# Altium project ADS1256.PrjPcb
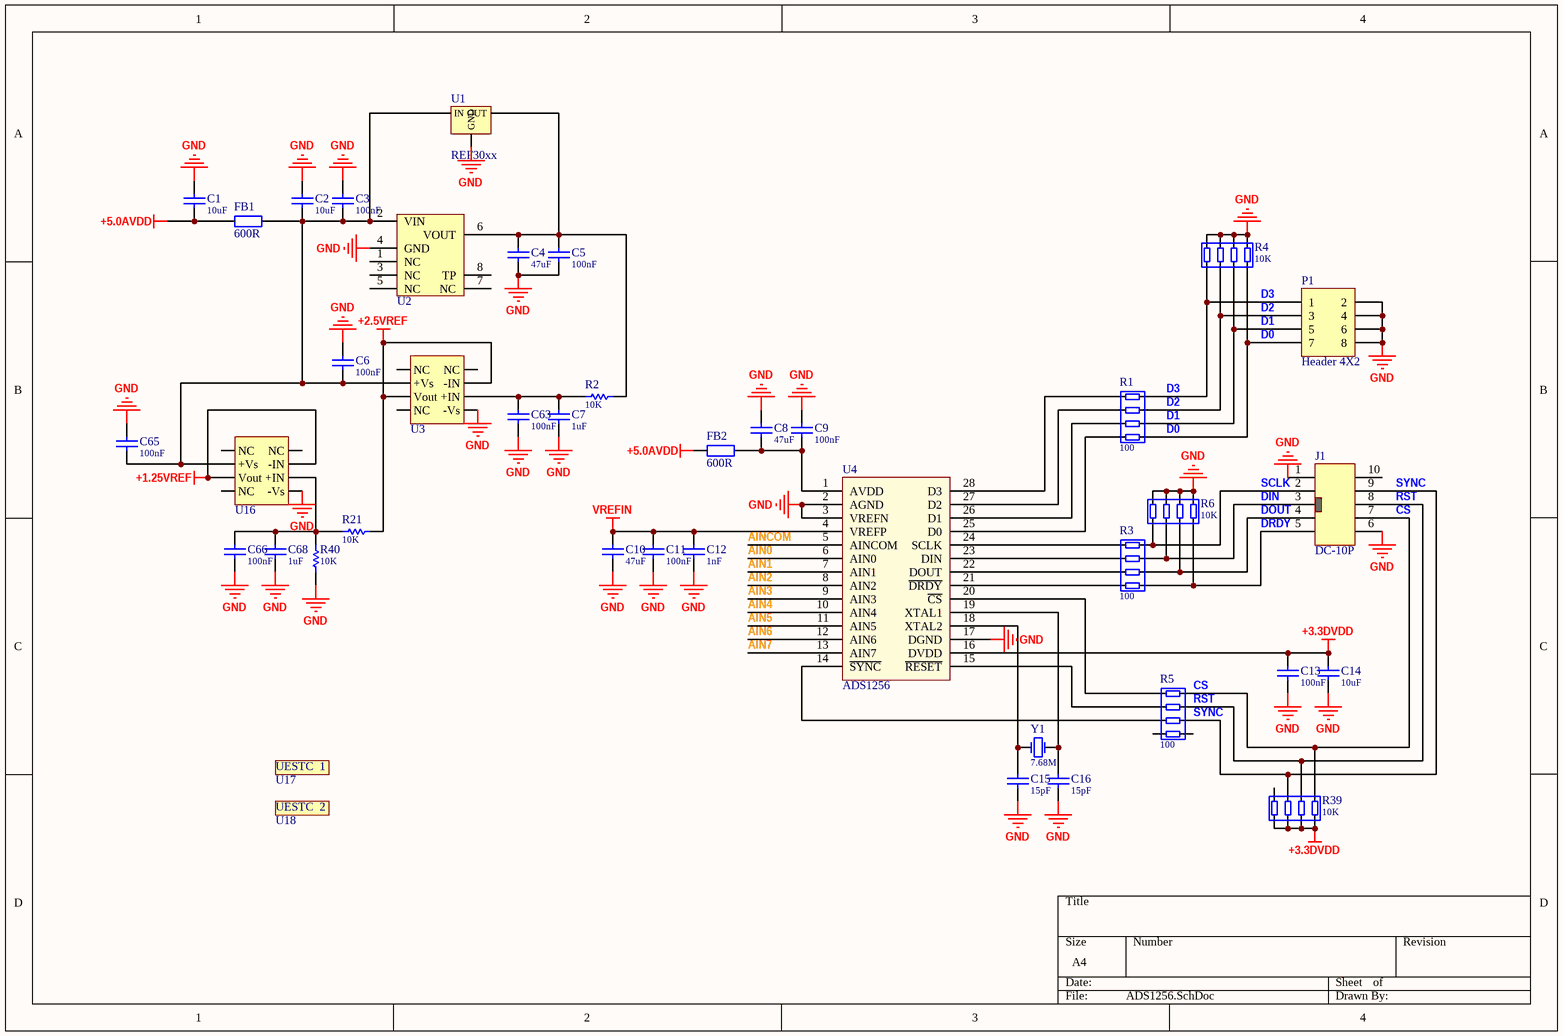
[diagram p0: ADS1256.SchDoc]
3 sheets, 175 parts. Net scope: global (net labels, ports and power ports of the same name join across sheets).
Board file: ADS1256.PcbDoc
Sheets:
  ADS1256.SchDoc
  POWER.SchDoc
  Analog.SchDoc

## Sheet ADS1256.SchDoc
size A4

### Parts
C1  value 10uF  [C0603-L]  (hidden comment: Cap-S)
C2  value 10uF  [C0603-L]  (hidden comment: Cap-S)
C3  value 100nF  [C0402-L]  (hidden comment: Cap-S)
C4  value 47uF  [C0805-L]  (hidden comment: Cap-S)
C5  value 100nF  [C0402-L]  (hidden comment: Cap-S)
C6  value 100nF  [C0402-L]  (hidden comment: Cap-S)
C7  value 1uF  [C0603-L]  (hidden comment: Cap-S)
C8  value 47uF  [C0805-L]  (hidden comment: Cap-S)
C9  value 100nF  [C0402-L]  (hidden comment: Cap-S)
C10  value 47uF  [C0805-L]  (hidden comment: Cap-S)
C11  value 100nF  [C0402-L]  (hidden comment: Cap-S)
C12  value 1nF  [C0402-L]  (hidden comment: Cap-S)
C13  value 100nF  [C0402-L]  (hidden comment: Cap-S)
C14  value 10uF  [C0603-L]  (hidden comment: Cap-S)
C15  value 15pF  [C0603-L]  (hidden comment: Cap-S)
C16  value 15pF  [C0603-L]  (hidden comment: Cap-S)
C63  value 100nF  [C0402-L]  (hidden comment: Cap-S)
C65  value 100nF  [C0402-L]  (hidden comment: Cap-S)
C66  value 100nF  [C0402-L]  (hidden comment: Cap-S)
C68  value 1uF  [C0603-L]  (hidden comment: Cap-S)
FB1  600R  [FB-0805]
FB2  600R  [FB-0805]
J1  DC-10P  [DC-10P]
P1  Header 4X2  [HDR2X4]
R1  value 100  [R0603X4]  (hidden comment: R)
R2  value 10K  [R0603-L]  (hidden comment: R)
R3  value 100  [R0603X4]  (hidden comment: R)
R4  value 10K  [R0603X4]  (hidden comment: R)
R5  value 100  [R0603X4]  (hidden comment: R)
R6  value 10K  [R0603X4]  (hidden comment: R)
R21  value 10K  [R0603-L]  (hidden comment: R)
R39  value 10K  [R0603X4]  (hidden comment: R)
R40  value 10K  [R0603-L]  (hidden comment: R)
U1  REF30xx  [SOT23-3_L]
U2  ADR45xx  [SOIC-8_N]  (value not drawn)
U3  OPA657  [SOIC-8_N]  (value not drawn)
U4  ADS1256  [TSSOP-28]
U16  OPA657  [SOIC-8_N]  (value not drawn)
U17  UESTC  1  [UESTC]  (value not drawn)
U18  UESTC  2  [UESTC  2]  (value not drawn)
Y1  value 7.68M  [XTAL-PB2-SMD]  (hidden comment: XTAL)

### Nets
+1.25VREF: U16.2(-IN) U16.6(Vout)
+2.5VREF: R21.2 U3.2(-IN) U3.6(Vout)
+3.3DVDD: C13.2 C14.2 R39.1 R39.2 R39.3 R39.4 U4.16(DVDD)
+5.0AVDD: C1.1 FB1.1 FB2.1
GND: C1.2 C2.2 C3.1 C4.1 C5.1 C6.1 C7.1 C8.2 C9.1 C10.2 C11.1 C12.1 C13.1 C14.1 C15.2 C16.2 C63.1 C65.1 C66.1 C68.1 J1.1 J1.6 P1.2 P1.4 P1.6 P1.8 R4.5 R4.6 R4.7 R4.8 R6.5 R6.6 R6.7 R6.8 R40.1 U1.3(GND) U2.4(GND) U3.4(-Vs) U4.2(AGND) U4.3(VREFN) U4.17(DGND) U16.4(-Vs)
VREFIN: C10.1 C11.2 C12.2 U4.4(VREFP)
AIN0: U4.6(AIN0)
AIN1: U4.7(AIN1)
AIN2: U4.8(AIN2)
AIN3: U4.9(AIN3)
AIN4: U4.10(AIN4)
AIN5: U4.11(AIN5)
AIN6: U4.12(AIN6)
AIN7: U4.13(AIN7)
AINCOM: U4.5(AINCOM)
CS: J1.7 R5.8 R39.8
D0: P1.7 R1.5 R4.1
D1: P1.5 R1.6 R4.2
D2: P1.3 R1.7 R4.3
D3: P1.1 R1.8 R4.4
DIN: J1.3 R3.7 R6.3
DOUT: J1.4 R3.6 R6.2
DRDY: J1.5 R3.5 R6.1
RST: J1.8 R5.7 R39.7
SCLK: J1.2 R3.8 R6.4
SYNC: J1.9 R5.6 R39.6
NetC2_1: C2.1 C3.2 C6.2 C65.2 FB1.2 U1.1(IN) U2.2(VIN) U3.7(+Vs) U16.7(+Vs)
NetC4_2: C4.2 C5.2 R2.2 U1.2(OUT) U2.6(VOUT)
NetC7_2: C7.2 C63.2 R2.1 U3.3(+IN)
NetC8_1: C8.1 C9.2 FB2.2 U4.1(AVDD)
NetC15_1: C15.1 U4.18(XTAL2) Y1.2(OSC2)
NetC16_1: C16.1 U4.19(XTAL1) Y1.1(OSC1)
NetC66_2: C66.2 C68.2 R21.1 R40.2 U16.3(+IN)
NetR1_1: R1.1 U4.28(D3)
NetR1_2: R1.2 U4.27(D2)
NetR1_3: R1.3 U4.26(D1)
NetR1_4: R1.4 U4.25(D0)
NetR3_1: R3.1 U4.24(SCLK)
NetR3_2: R3.2 U4.23(DIN)
NetR3_3: R3.3 U4.22(DOUT)
NetR3_4: R3.4 U4.21(~{DRDY})
NetR5_1: R5.1 U4.20(~{CS})
NetR5_2: R5.2 U4.15(~{RESET})
NetR5_3: R5.3 U4.14(~{SYNC})

Not connected (* = marked no-connect by the designer): J1 10; R5 4 5; R39 5; U2 1(NC) 3(NC) 5(NC) 7(NC) 8(TP); U3 1(NC) 5(NC) 8(NC); U16 1(NC) 5(NC) 8(NC)

### Library data of the parts
C1-C16 C63 C65 C66 C68 = Cap-S: 贴片瓷片电容
FB1 FB2 = FB
P1 = Header 4X2: Header, 4-Pin, Dual row; LatestRevisionDate: 17-Jul-2002; LatestRevisionNote: Re-released for DXP Platform.; Publisher: Altium Limited
R1 R3-R6 R39 = Res-4R: 排阻 4
R2 R21 R40 = Res: 贴片电阻
U1 = REF3025: 采用 SOT23-3 封装的 2.5V 输出 50ppm/℃ 漂移 50uA 静态电流的（带隙）电压参考
U2 = ADR45xx: 超低噪声、高精度  基准电压源
U3 U16 = OPA657: 1.6-GHz, Low-Noise, FET-Input Operational Amplifier; Manufacturer: Texas Instruments; PartNumber: OPA656U; 2nd Harmonic(dBc): 74; 3rd Harmonic(dBc): 100; @ MHz: 5; Acl, min stable gain(V/V): 1; BW @ Acl(MHz): 500; Diff Gain(%): 0.02; Diff Phase(deg): 0.05; Eco-Plan: Green (RoHS & no Sb/Br); Io(Typ)(mA): 70; Iq per channel(Max)(mA): 16; Slew Rate(Typ)(V/us): 290; Sub Family: High Output Current Amplifier (>=50mA), High Speed Amplifier (>=50MHz), Low Input Bias Current Amp (<=10pA); THD (Fc is 1 MHz)(Typ)(dB): -74; Vio(Max)(mV): 0.6; Vn at Flatband(Typ)(nV/rtHz): 7; Vs(Max)(V): 12; Vs(Min)(V): 10; DatasheetVersion: SBOS196G; PackageVersion: 4040047-3/M, 06/2011; PackageReference: D8; PackageDescription: 8-Pin Plastic Small Outline, Body 4.9 x 3.9 mm, Pitch 1.27 mm; Supplier 1: Digi-Key; Supplier Part Number 1: OPA656U-ND; Supplier 2: Farnell; Supplier Part Number 2: 1212322; Supplier 3: Newark; Supplier Part Number 3: 75C5137; Supplier 4: Mouser; Supplier Part Number 4: 595-OPA656U; Iib(Max)(nA): 0.02; Number of Channels: 1; Settling Time (0.1%)(Typ)(ns): 16; Mounting Technology: Surface Mount; Code_JEDEC: MS-012; ComponentLink1Description: Manufacturer URL; ComponentLink1URL: http://www.ti.com/; ComponentLink2Description: Datasheet; ComponentLink2URL: http://www.ti.com/general/docs/lit/getliterature.tsp?genericPartNumber=OPA656&fileType=pdf; ComponentLink3Description: Package Specification; ComponentLink3URL: http://www.ti.com/litv/pdf/msoi002j
Y1 = XTAL: 晶振

## Sheet POWER.SchDoc
size A4
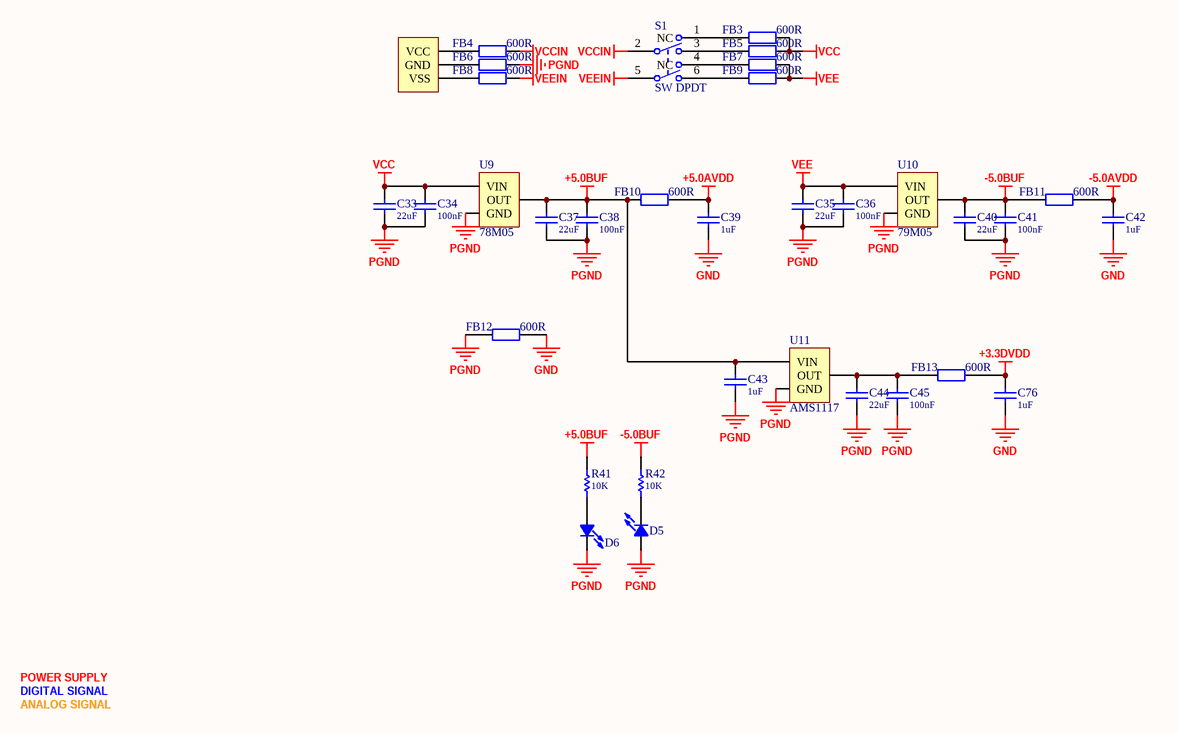
[diagram p1: POWER.SchDoc]

### Parts
C33  value 22uF  [C0805-L]  (hidden comment: Cap-S)
C34  value 100nF  [C0603-L]  (hidden comment: Cap-S)
C35  value 22uF  [C0805-L]  (hidden comment: Cap-S)
C36  value 100nF  [C0603-L]  (hidden comment: Cap-S)
C37  value 22uF  [C0805-L]  (hidden comment: Cap-S)
C38  value 100nF  [C0603-L]  (hidden comment: Cap-S)
C39  value 1uF  [C0603-L]  (hidden comment: Cap-S)
C40  value 22uF  [C0805-L]  (hidden comment: Cap-S)
C41  value 100nF  [C0603-L]  (hidden comment: Cap-S)
C42  value 1uF  [C0603-L]  (hidden comment: Cap-S)
C43  value 1uF  [C0603-L]  (hidden comment: Cap-S)
C44  value 22uF  [C0805-L]  (hidden comment: Cap-S)
C45  value 100nF  [C0603-L]  (hidden comment: Cap-S)
C76  value 1uF  [C0603-L]  (hidden comment: Cap-S)
D5  LED  [Led-0805_L]  (value not drawn)
D6  LED  [Led-0805_L]  (value not drawn)
FB3  600R  [FB-0805]
FB4  600R  [FB-0805]
FB5  600R  [FB-0805]
FB6  600R  [FB-0805]
FB7  600R  [FB-0805]
FB8  600R  [FB-0805]
FB9  600R  [FB-0805]
FB10  600R  [FB-0805]
FB11  600R  [FB-0805]
FB12  600R  [FB-0805]
FB13  600R  [FB-0805]
J2  Power-3P  [SIPA03]  (value not drawn)
R41  value 10K  [R0603-L]  (hidden comment: R)
R42  value 10K  [R0603-L]  (hidden comment: R)
S1  SW DPDT  [SW_DPDT]
U9  78M05  [TO-252]
U10  79M05  [TO-252]
U11  AMS1117  [SOT-223]

### Nets
+3.3DVDD: C76.2 FB13.2
+5.0AVDD: C39.2 FB10.2
+5.0BUF: C37.2 C38.2 C43.2 FB10.1 R41.2 U9.3(OUT) U11.3(VIN)
-5.0AVDD: C42.2 FB11.2
-5.0BUF: C40.2 C41.2 FB11.1 R42.2 U10.3(OUT)
GND: C39.1 C42.1 C76.1 FB12.2
PGND: C33.1 C34.1 C35.1 C36.1 C37.1 C38.1 C40.1 C41.1 C43.1 C44.1 C45.1 D5.1 D6.2 FB6.2 FB12.1 U9.2(GND) U10.1(GND) U11.1(GND)
VCC: C33.2 C34.2 FB3.2 FB5.2 U9.1(VIN)
VCCIN: FB4.2 S1.2
VEE: C35.2 C36.2 FB7.2 FB9.2 U10.2(VIN)
VEEIN: FB8.2 S1.5(COMMON2)
NetC44_2: C44.2 C45.2 FB13.1 U11.2(OUT)
NetD5_2: D5.2 R42.1
NetD6_1: D6.1 R41.1
NetFB3_1: FB3.1 S1.1(NC)
NetFB4_1: FB4.1 J2.1(VCC)
NetFB5_1: FB5.1 S1.3(NO1)
NetFB6_1: FB6.1 J2.2(GND)
NetFB7_1: FB7.1 S1.4(NC)
NetFB8_1: FB8.1 J2.3(VSS)
NetFB9_1: FB9.1 S1.6(NO2)

### Notes on the sheet
- Labels drawn without touching a wire or pin: ANALOG SIGNAL, DIGITAL SIGNAL, POWER SUPPLY

### Library data of the parts
C33-C45 C76 = Cap-S: 贴片瓷片电容
D5 D6 = LED: 发光二极管
FB3-FB13 = FB
J2 = Power-3P: 供电端子
R41 R42 = Res: 贴片电阻
S1 = SW DPDT: 自锁开关; Published: 24-Mar-1999; LatestRevisionDate: 29-May-2009; LatestRevisionNote: IPC-7351 Footprint Added.; PackageVersion: Mar-2001; PackageReference: SOT23-6; Publisher: Altium Limited; PackageDescription: 6-Pin SOT-23 Package 0.95 mm Pitch, 2.7 mm Lead Span; Code_JEITA: SC-74; Code_IPC: SOT26A-6

## Sheet Analog.SchDoc
size A3
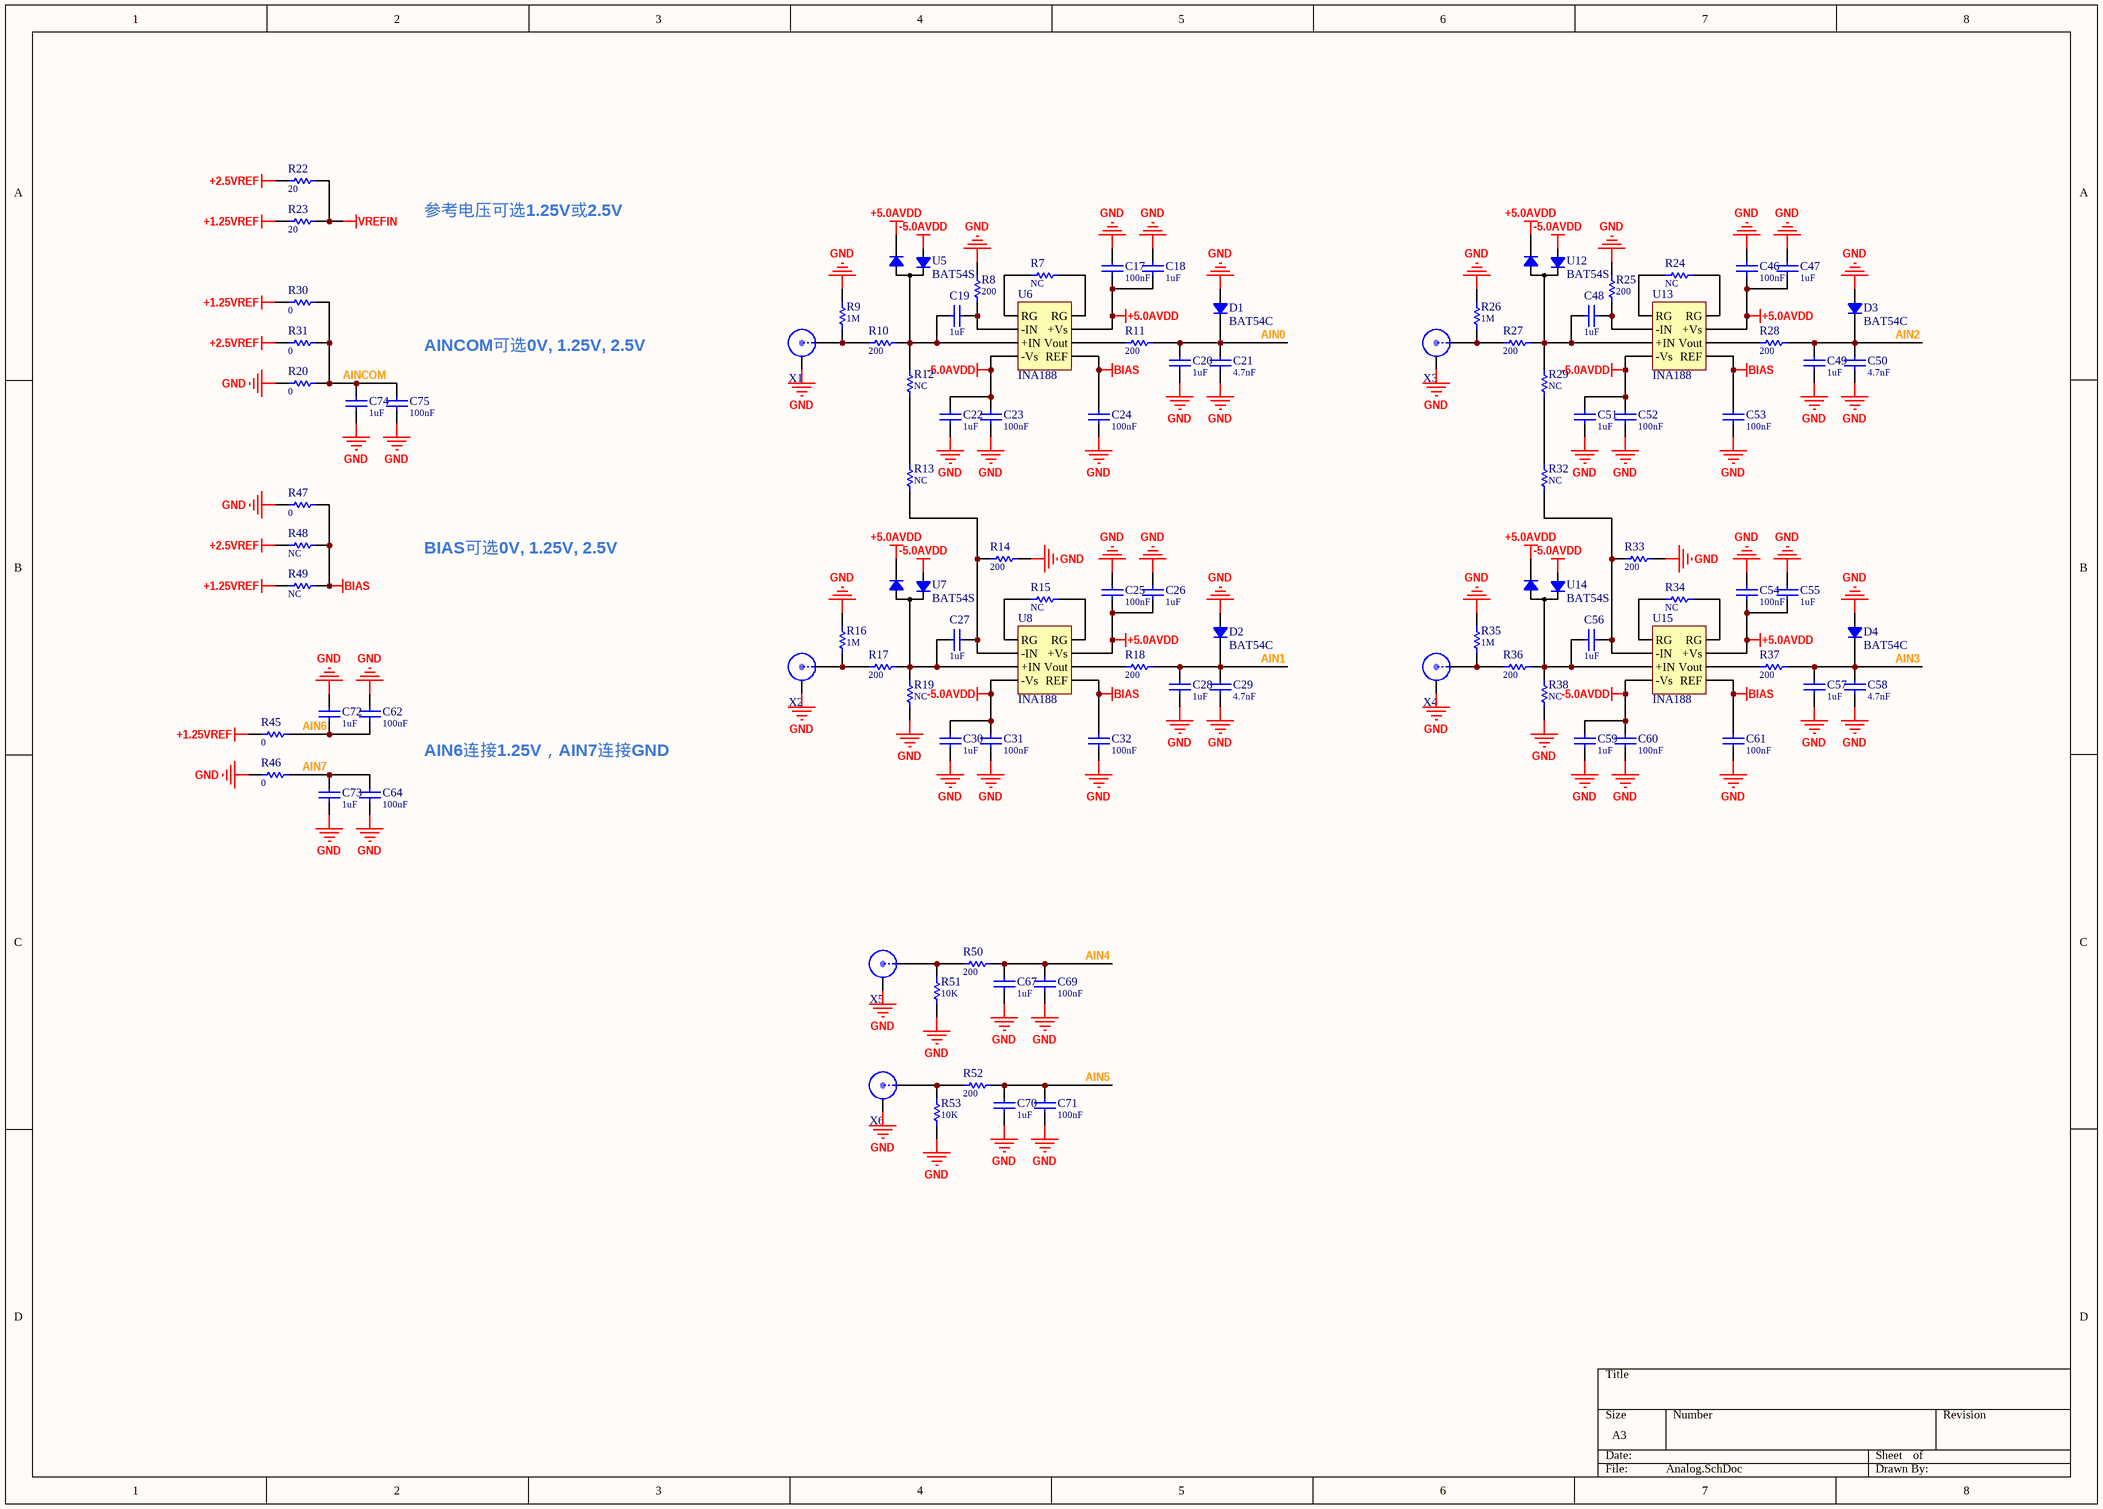
[diagram p2: Analog.SchDoc]

### Parts
C17  value 100nF  [C0402-L]  (hidden comment: Cap-S)
C18  value 1uF  [C0603-L]  (hidden comment: Cap-S)
C19  value 1uF  [C0603-L]  (hidden comment: Cap-S)
C20  value 1uF  [C0603-L]  (hidden comment: Cap-S)
C21  value 4.7nF  [C0402-L]  (hidden comment: Cap-S)
C22  value 1uF  [C0603-L]  (hidden comment: Cap-S)
C23  value 100nF  [C0402-L]  (hidden comment: Cap-S)
C24  value 100nF  [C0402-L]  (hidden comment: Cap-S)
C25  value 100nF  [C0402-L]  (hidden comment: Cap-S)
C26  value 1uF  [C0603-L]  (hidden comment: Cap-S)
C27  value 1uF  [C0603-L]  (hidden comment: Cap-S)
C28  value 1uF  [C0603-L]  (hidden comment: Cap-S)
C29  value 4.7nF  [C0402-L]  (hidden comment: Cap-S)
C30  value 1uF  [C0603-L]  (hidden comment: Cap-S)
C31  value 100nF  [C0402-L]  (hidden comment: Cap-S)
C32  value 100nF  [C0402-L]  (hidden comment: Cap-S)
C46  value 100nF  [C0402-L]  (hidden comment: Cap-S)
C47  value 1uF  [C0603-L]  (hidden comment: Cap-S)
C48  value 1uF  [C0603-L]  (hidden comment: Cap-S)
C49  value 1uF  [C0603-L]  (hidden comment: Cap-S)
C50  value 4.7nF  [C0402-L]  (hidden comment: Cap-S)
C51  value 1uF  [C0603-L]  (hidden comment: Cap-S)
C52  value 100nF  [C0402-L]  (hidden comment: Cap-S)
C53  value 100nF  [C0402-L]  (hidden comment: Cap-S)
C54  value 100nF  [C0402-L]  (hidden comment: Cap-S)
C55  value 1uF  [C0603-L]  (hidden comment: Cap-S)
C56  value 1uF  [C0603-L]  (hidden comment: Cap-S)
C57  value 1uF  [C0603-L]  (hidden comment: Cap-S)
C58  value 4.7nF  [C0402-L]  (hidden comment: Cap-S)
C59  value 1uF  [C0603-L]  (hidden comment: Cap-S)
C60  value 100nF  [C0402-L]  (hidden comment: Cap-S)
C61  value 100nF  [C0402-L]  (hidden comment: Cap-S)
C62  value 100nF  [C0402-L]  (hidden comment: Cap-S)
C64  value 100nF  [C0402-L]  (hidden comment: Cap-S)
C67  value 1uF  [C0603-L]  (hidden comment: Cap-S)
C69  value 100nF  [C0402-L]  (hidden comment: Cap-S)
C70  value 1uF  [C0603-L]  (hidden comment: Cap-S)
C71  value 100nF  [C0402-L]  (hidden comment: Cap-S)
C72  value 1uF  [C0603-L]  (hidden comment: Cap-S)
C73  value 1uF  [C0603-L]  (hidden comment: Cap-S)
C74  value 1uF  [C0603-L]  (hidden comment: Cap-S)
C75  value 100nF  [C0402-L]  (hidden comment: Cap-S)
D1  BAT54C  [SOT-23-2]
D2  BAT54C  [SOT-23-2]
D3  BAT54C  [SOT-23-2]
D4  BAT54C  [SOT-23-2]
R7  value NC  [R0603-L]  (hidden comment: R)
R8  value 200  [R0603-L]  (hidden comment: R)
R9  value 1M  [R0603-L]  (hidden comment: R)
R10  value 200  [R0603-L]  (hidden comment: R)
R11  value 200  [R0603-L]  (hidden comment: R)
R12  value NC  [R0603-L]  (hidden comment: R)
R13  value NC  [R0603-L]  (hidden comment: R)
R14  value 200  [R0603-L]  (hidden comment: R)
R15  value NC  [R0603-L]  (hidden comment: R)
R16  value 1M  [R0603-L]  (hidden comment: R)
R17  value 200  [R0603-L]  (hidden comment: R)
R18  value 200  [R0603-L]  (hidden comment: R)
R19  value NC  [R0603-L]  (hidden comment: R)
R20  value 0  [R0603-L]  (hidden comment: R)
R22  value 20  [R0603-L]  (hidden comment: R)
R23  value 20  [R0603-L]  (hidden comment: R)
R24  value NC  [R0603-L]  (hidden comment: R)
R25  value 200  [R0603-L]  (hidden comment: R)
R26  value 1M  [R0603-L]  (hidden comment: R)
R27  value 200  [R0603-L]  (hidden comment: R)
R28  value 200  [R0603-L]  (hidden comment: R)
R29  value NC  [R0603-L]  (hidden comment: R)
R30  value 0  [R0603-L]  (hidden comment: R)
R31  value 0  [R0603-L]  (hidden comment: R)
R32  value NC  [R0603-L]  (hidden comment: R)
R33  value 200  [R0603-L]  (hidden comment: R)
R34  value NC  [R0603-L]  (hidden comment: R)
R35  value 1M  [R0603-L]  (hidden comment: R)
R36  value 200  [R0603-L]  (hidden comment: R)
R37  value 200  [R0603-L]  (hidden comment: R)
R38  value NC  [R0603-L]  (hidden comment: R)
R45  value 0  [R0603-L]  (hidden comment: R)
R46  value 0  [R0603-L]  (hidden comment: R)
R47  value 0  [R0603-L]  (hidden comment: R)
R48  value NC  [R0603-L]  (hidden comment: R)
R49  value NC  [R0603-L]  (hidden comment: R)
R50  value 200  [R0603-L]  (hidden comment: R)
R51  value 10K  [R0603-L]  (hidden comment: R)
R52  value 200  [R0603-L]  (hidden comment: R)
R53  value 10K  [R0603-L]  (hidden comment: R)
U5  BAT54S  [SOT-23-3]
U6  INA188  [SOP-8]
U7  BAT54S  [SOT-23-3]
U8  INA188  [SOP-8]
U12  BAT54S  [SOT-23-3]
U13  INA188  [SOP-8]
U14  BAT54S  [SOT-23-3]
U15  INA188  [SOP-8]
X1  SMA  [SMA_ANGLE]  (value not drawn)
X2  SMA  [SMA_ANGLE]  (value not drawn)
X3  SMA  [SMA_ANGLE]  (value not drawn)
X4  SMA  [SMA_ANGLE]  (value not drawn)
X5  SMA  [SMA_ANGLE]  (value not drawn)
X6  SMA  [SMA_ANGLE]  (value not drawn)

### Nets
+1.25VREF: R23.1 R30.2 R45.2 R49.2
+2.5VREF: R22.1 R31.2 R48.2
+5.0AVDD: C17.2 C18.2 C25.2 C26.2 C46.2 C47.2 C54.2 C55.2 U5.3 U6.7(+Vs) U7.3 U8.7(+Vs) U12.3 U13.7(+Vs) U14.3 U15.7(+Vs)
-5.0AVDD: C22.1 C23.2 C30.1 C31.2 C51.1 C52.2 C59.1 C60.2 U5.1 U6.4(-Vs) U7.1 U8.4(-Vs) U12.1 U13.4(-Vs) U14.1 U15.4(-Vs)
BIAS: C24.2 C32.2 C53.2 C61.2 R47.1 R48.1 R49.1 U6.5(REF) U8.5(REF) U13.5(REF) U15.5(REF)
GND: C17.1 C18.1 C20.2 C21.2 C22.2 C23.1 C24.1 C25.1 C26.1 C28.2 C29.2 C30.2 C31.1 C32.1 C46.1 C47.1 C49.2 C50.2 C51.2 C52.1 C53.1 C54.1 C55.1 C57.2 C58.2 C59.2 C60.1 C61.1 C62.1 C64.2 C67.1 C69.1 C70.1 C71.1 C72.2 C73.2 C74.2 C75.2 D1.1 D2.1 D3.1 D4.1 R8.2 R9.1 R14.1 R16.1 R19.1 R20.2 R25.2 R26.1 R33.1 R35.1 R38.1 R46.2 R47.2 R51.2 R53.2 X1.2 X2.2 X3.2 X4.2 X5.2 X6.2
VREFIN: R22.2 R23.2
AIN0: C20.1 C21.1 D1.2 R11.1
AIN1: C28.1 C29.1 D2.2 R18.1
AIN2: C49.1 C50.1 D3.2 R28.1
AIN3: C57.1 C58.1 D4.2 R37.1
AIN4: C67.2 C69.2 R50.1
AIN5: C70.2 C71.2 R52.1
AIN6: C62.2 C72.1 R45.1
AIN7: C64.1 C73.1 R46.1
AINCOM: C74.1 C75.1 R20.1 R30.1 R31.1
NetC19_1: C19.1 R8.1 U6.2(-IN)
NetC19_2: C19.2 R10.1 R12.1 U5.2 U6.3(+IN)
NetC27_1: C27.1 R13.2 R14.2 U8.2(-IN)
NetC27_2: C27.2 R17.1 R19.2 U7.2 U8.3(+IN)
NetC48_1: C48.1 R25.1 U13.2(-IN)
NetC48_2: C48.2 R27.1 R29.1 U12.2 U13.3(+IN)
NetC56_1: C56.1 R32.2 R33.2 U15.2(-IN)
NetC56_2: C56.2 R36.1 R38.2 U14.2 U15.3(+IN)
NetR7_1: R7.1 U6.8(RG)
NetR7_2: R7.2 U6.1(RG)
NetR9_2: R9.2 R10.2 X1.1
NetR11_2: R11.2 U6.6(Vout)
NetR12_2: R12.2 R13.1
NetR15_1: R15.1 U8.8(RG)
NetR15_2: R15.2 U8.1(RG)
NetR16_2: R16.2 R17.2 X2.1
NetR18_2: R18.2 U8.6(Vout)
NetR24_1: R24.1 U13.8(RG)
NetR24_2: R24.2 U13.1(RG)
NetR26_2: R26.2 R27.2 X3.1
NetR28_2: R28.2 U13.6(Vout)
NetR29_2: R29.2 R32.1
NetR34_1: R34.1 U15.8(RG)
NetR34_2: R34.2 U15.1(RG)
NetR35_2: R35.2 R36.2 X4.1
NetR37_2: R37.2 U15.6(Vout)
NetR50_2: R50.2 R51.1 X5.1
NetR52_2: R52.2 R53.1 X6.1

### Notes on the sheet
- 参考电压可选1.25V或2.5V
- (near C75) AINCOM可选0V, 1.25V, 2.5V
- BIAS可选0V, 1.25V, 2.5V
- AIN6连接1.25V，AIN7连接GND

### Library data of the parts
C17-C32 C46-C62 C64 C67 C69-C75 = Cap-S: 贴片瓷片电容
R7-R20 R22-R38 R45-R53 = Res: 贴片电阻
U6 U8 U13 U15 = InAmp

## Nets that join several sheets
+1.25VREF: ADS1256 (U16.2 U16.6), Analog (R23.1 R30.2 R45.2 R49.2)
+2.5VREF: ADS1256 (R21.2 U3.2 U3.6), Analog (R22.1 R31.2 R48.2)
+3.3DVDD: ADS1256 (7 pins), POWER (C76.2 FB13.2)
+5.0AVDD: ADS1256 (C1.1 FB1.1 FB2.1), POWER (C39.2 FB10.2), Analog (16 pins)
-5.0AVDD: POWER (C42.2 FB11.2), Analog (16 pins)
GND: ADS1256 (42 pins), POWER (C39.1 C42.1 C76.1 FB12.2), Analog (63 pins)
VREFIN: ADS1256 (C10.1 C11.2 C12.2 U4.4), Analog (R22.2 R23.2)
AIN0: ADS1256 (U4.6), Analog (C20.1 C21.1 D1.2 R11.1)
AIN1: ADS1256 (U4.7), Analog (C28.1 C29.1 D2.2 R18.1)
AIN2: ADS1256 (U4.8), Analog (C49.1 C50.1 D3.2 R28.1)
AIN3: ADS1256 (U4.9), Analog (C57.1 C58.1 D4.2 R37.1)
AIN4: ADS1256 (U4.10), Analog (C67.2 C69.2 R50.1)
AIN5: ADS1256 (U4.11), Analog (C70.2 C71.2 R52.1)
AIN6: ADS1256 (U4.12), Analog (C62.2 C72.1 R45.1)
AIN7: ADS1256 (U4.13), Analog (C64.1 C73.1 R46.1)
AINCOM: ADS1256 (U4.5), Analog (5 pins)